# Altium project Diseño2.PrjPcb
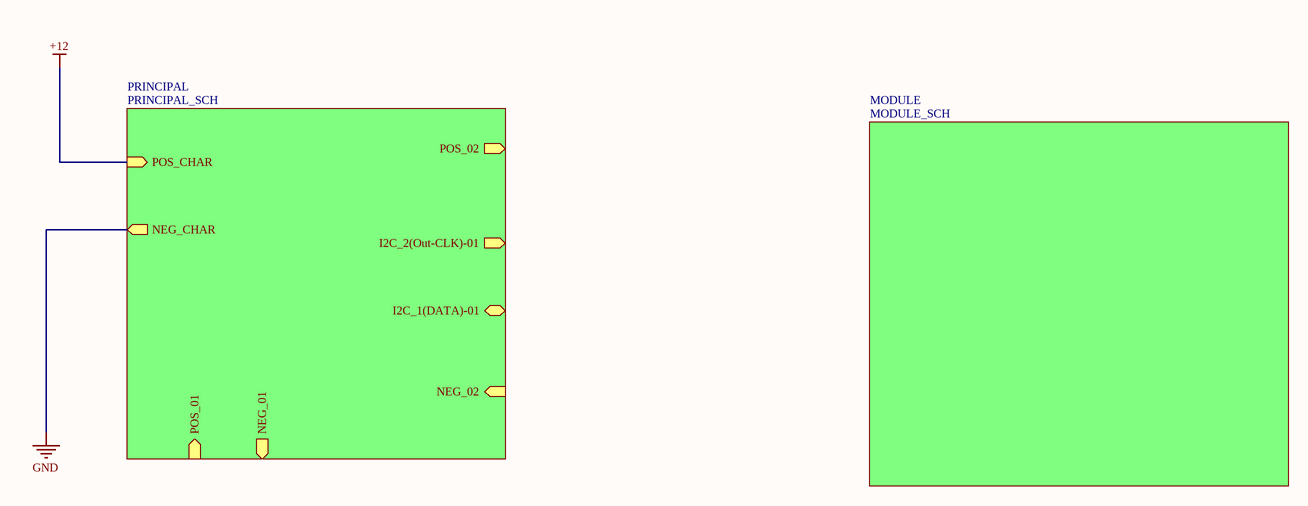
[diagram p0: GENERAL.SchDoc]
3 sheets, 32 parts. Net scope: hierarchical (ports join the sheet entries above them; power ports are global).
Sheets:
  GENERAL.SchDoc
    PRINCIPAL = PRINCIPAL_SCH.SchDoc
    MODULE = MODULE_SCH.SchDoc

## Sheet GENERAL.SchDoc
size A4; SheetNumber: 1; SheetTotal: 5

### Sub-sheets
MODULE = MODULE_SCH: no entries
PRINCIPAL = PRINCIPAL_SCH: POS_02 (out), I2C_2(Out-CLK)-01 (out), I2C_1(DATA)-01 (bidir), NEG_02 (in), POS_CHAR (in), NEG_CHAR (out), POS_01 (in), NEG_01 (out)

### Nets
+12: sheet PRINCIPAL/POS_CHAR
GND: sheet PRINCIPAL/NEG_02, sheet PRINCIPAL/NEG_CHAR, sheet PRINCIPAL/NEG_01

## Sheet PRINCIPAL_SCH.SchDoc
size A4; SheetNumber: 2; SheetTotal: 3
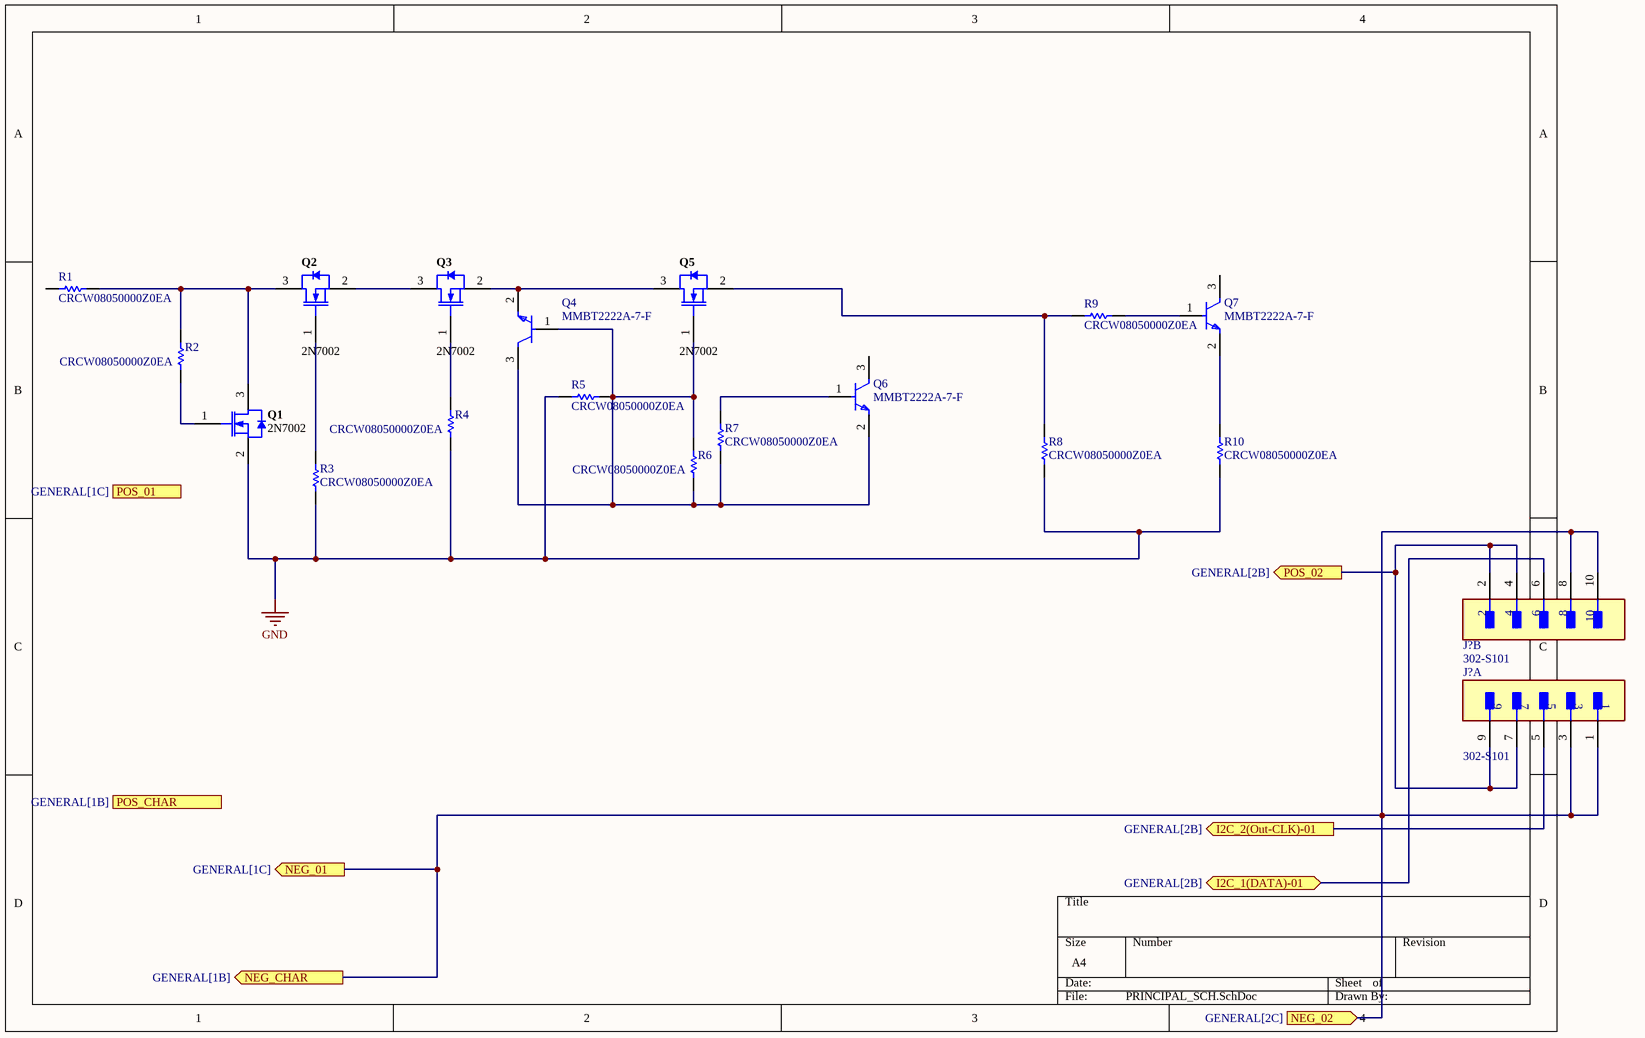
[diagram p1: PRINCIPAL_SCH.SchDoc]

### Parts
(Parts that share a designator on the sheet are numbered #1, #2 ... from top to bottom, then left to right.)
J?#1  302-S101  [FP-302-S101-MFG]  (part B of 2)
J?#2  302-S101  [FP-302-S101-MFG]  (part A of 2)
Q1  2N7002  [INF-PG-SOT23_M]
Q2  2N7002  [INF-PG-SOT23_M]
Q3  2N7002  [INF-PG-SOT23_M]
Q4  MMBT2222A-7-F  [FP-SOT23-IPC_A]
Q5  2N7002  [INF-PG-SOT23_M]
Q6  MMBT2222A-7-F  [FP-SOT23-IPC_A]
Q7  MMBT2222A-7-F  [FP-SOT23-IPC_A]
R1  CRCW08050000Z0EA  [RESC2013X50X30LL20T20]
R2  CRCW08050000Z0EA  [RESC2013X50X30LL20T20]
R3  CRCW08050000Z0EA  [RESC2013X50X30LL20T20]
R4  CRCW08050000Z0EA  [RESC2013X50X30LL20T20]
R5  CRCW08050000Z0EA  [RESC2013X50X30LL20T20]
R6  CRCW08050000Z0EA  [RESC2013X50X30LL20T20]
R7  CRCW08050000Z0EA  [RESC2013X50X30LL20T20]
R8  CRCW08050000Z0EA  [RESC2013X50X30LL20T20]
R9  CRCW08050000Z0EA  [RESC2013X50X30LL20T20]
R10  CRCW08050000Z0EA  [RESC2013X50X30LL20T20]

### Ports
I2C_1(DATA)-01 (bidir, see GENERAL[2B]), I2C_2(Out-CLK)-01 (out, see GENERAL[2B]), NEG_01 (out, see GENERAL[1C]), NEG_02 (in, see GENERAL[2C]), NEG_CHAR (out, see GENERAL[1B]), POS_01 (in, see GENERAL[1C]), POS_02 (out, see GENERAL[2B]), POS_CHAR (in, see GENERAL[1B])

### Nets
GND: J?#1.8 J?#1.10 J?#2.1 J?#2.3 Q1.2(SOURCE) R3.1 R4.1 R5.1 R8.1 R10.1 ; port NEG_02, port NEG_01, port NEG_CHAR
NetJ?#1_2: J?#1.2 J?#1.4 J?#2.7 J?#2.9 ; port POS_02
NetJ?#1_6: J?#1.6 ; port I2C_1(DATA)-01
NetJ?#2_5: J?#2.5 ; port I2C_2(Out-CLK)-01
NetQ1_1: Q1.1(GATE) R2.1
NetQ1_3: Q1.3(DRAIN) Q2.3(DRAIN) R1.2 R2.2
NetQ2_1: Q2.1(GATE) R3.2
NetQ2_2: Q2.2(SOURCE) Q3.3(DRAIN)
NetQ3_1: Q3.1(GATE) R4.2
NetQ3_2: Q3.2(SOURCE) Q4.2(E) Q5.3(DRAIN)
NetQ4_1: Q4.1(B) Q4.3(C) Q5.1(GATE) Q6.2(E) R5.2 R6.1 R6.2 R7.2
NetQ5_2: Q5.2(SOURCE) R8.2 R9.1
NetQ6_1: Q6.1(B) R7.1
NetQ7_1: Q7.1(B) R9.2
NetQ7_2: Q7.2(E) R10.2

Not connected (* = marked no-connect by the designer): Q6 3(C); Q7 3(C); R1 1

### Library data of the parts
J?#1 J?#2 = CMP-15228-000002-1: CONN HEADER VERT 10POS 2.54MM; Voltage Rating: 250V; Row Spacing: 0.1inch; Number of Positions: 10; Mount: Through Hole; Series: 302; Contact Type: Male Pin; Contact Plating: Gold; Contact Material: Brass; Number of Rows: 2; Color: Black; Contact Finish - Mating: GOLD; Packaging: Bulk; Pitch: 0.1inch; Fastening Type: Pull; Insulation Color: Black; Termination: Solder; Flammability Rating: UL94 V-0; Connector Type: Header; Max Operating Temperature: 105°C; Insulation Material: Glass; Contact Shape: Square; Min Operating Temperature: -40°C
Q1-Q3 Q5 = CMP-1149-00026-1: N-Channel OptiMOS Small-Signal-Transistor, 60 V VDS, 0.3 A ID, -55 to 150 degC, PG-SOT23, Reel, Green; Manufacturer: Infineon; RDS (on) (max) (@4.5V): 4,000 mOhm; VDS (max): 60 V; IDpuls (max): 1.2Â A; QG: 0.4Â nC; RDS (on) (max): 3,000 mOhm; RthJA (max): 250 K/W; ID (max): 0.3Â A; VGS(th) (max): 2.5Â V; VGS(th) (min): 1.5Â V; Green: TRUE; Ptot (max): 0.5Â W; PackageDescription: 3-Pin Small Outline Transistor Package, 2.9 x 1.3 mm Body, 0.95 mm Pitch; Halogen-free: TRUE; ComponentLink2Description: Datasheet; ComponentLink1URL: http://www.infineon.com/; Packing: Reel; DatasheetVersion: Rev. 2.4; PartNumber: 2N7002; PackageReference: PG-SOT23; PackageVersion: Apr-08; ComponentLink3URL: http://www.infineon.com/dgdl/SOT23-Package_Overview.pdf?folderId=db3a30431936bc4b0119532290053c66&fileId=db3a30431936bc4b0119533468123c85; ComponentLink1Description: Manufacturer URL; Mounting Technology: Surface Mount; ComponentLink3Description: Package Specification; ComponentLink2URL: http://www.infineon.com/dgdl/2N7002_Rev2.4.pdf?folderId=db3a3043156fd573011622e10b5c1f67&fileId=db3a304319bc939a0119c2a9461e79e6
Q4 Q6 Q7 = CMP-1693-00003-4: TRANS NPN 40V 0.6A SMD SOT23-3; Number of Elements: 1; Frequency: 300MHz; Max Collector Current: 600mA; Collector Base Voltage (VCBO): 75V; Current: 1A; Element Configuration: Single; Power Dissipation: 350mW; hFE Min: 100; Collector Emitter Saturation Voltage: 1V; Max Power Dissipation: 300mW; Emitter Base Voltage (VEBO): 6V; Voltage: 40V; Collector Emitter Breakdown Voltage: 40V; Width: 1.4mm; Polarity: NPN; Termination: SMD/SMT; Max Operating Temperature: 150°C; Transition Frequency: 300MHz; Contact Plating: Tin; Mount: Surface Mount; Max Frequency: 300MHz; Case/Package: SOT-23; Gain Bandwidth Product: 300MHz; Lead Free: Lead Free; Collector Emitter Voltage (VCEO): 40V; Radiation Hardening: No; Voltage Rating (DC): 40V; Height: 1mm; Max Breakdown Voltage: 40V; Packaging: Tape and Reel; Length: 3.05mm; Min Operating Temperature: -55°C; Weight: 0.000282oz; Current Rating: 600mA; REACH SVHC: No SVHC; Package Quantity: 3000; Continuous Collector Current: 600mA; Number of Pins: 3
R1-R10 = CMP-2001-04896-1: Manufacturer: Vishay Dale; Part Number: CRCW08050000Z0EA

## Sheet MODULE_SCH.SchDoc
size A4; SheetNumber: 3; SheetTotal: 3
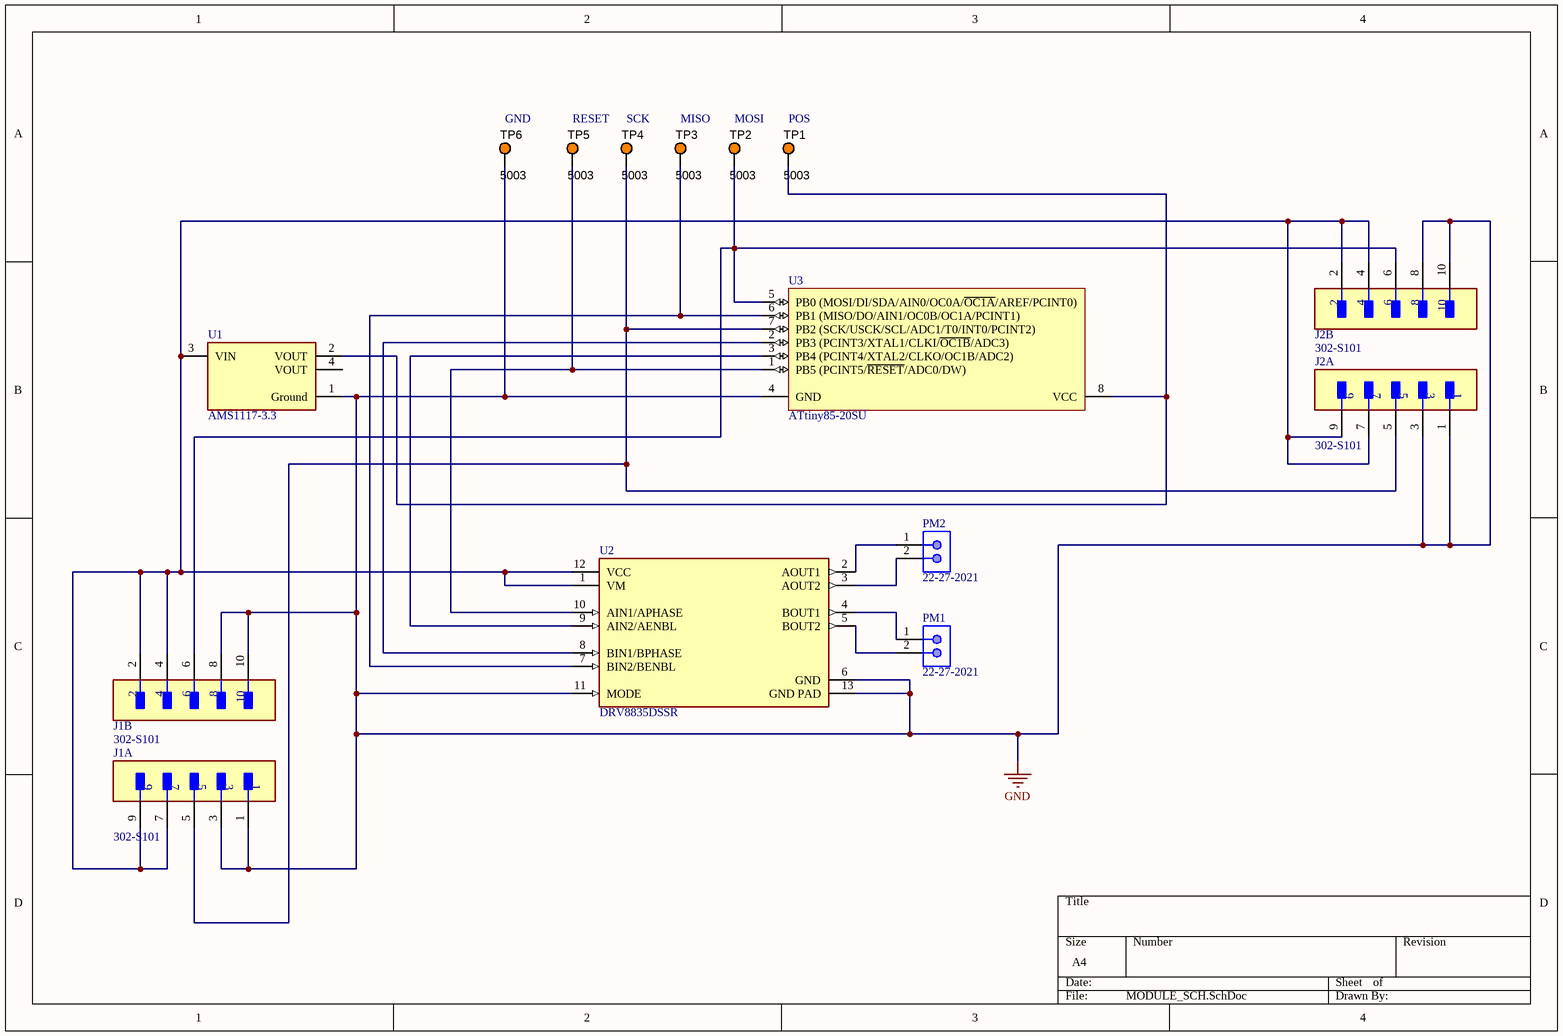
[diagram p2: MODULE_SCH.SchDoc]

### Parts
J1  302-S101  [FP-302-S101-MFG]  (parts A,B of 2)
J2  302-S101  [FP-302-S101-MFG]  (parts A,B of 2)
PM1  22-27-2021  [MOLX-22-27-2021_V]
PM2  22-27-2021  [MOLX-22-27-2021_V]
TP1  5003  [KSTN-5003]
TP2  5003  [KSTN-5003]
TP3  5003  [KSTN-5003]
TP4  5003  [KSTN-5003]
TP5  5003  [KSTN-5003]
TP6  5003  [KSTN-5003]
U1  AMS1117-3.3  [FP-AMS1117-IPC_C]
U2  DRV8835DSSR  [FP-DSS0012A-MFG]
U3  ATtiny85-20SU  [8S2_M]

### Nets
GND: J1.1 J1.3 J1.8 J1.10 J2.1 J2.3 J2.8 J2.10 TP6.1 U1.1(Ground) U2.6(GND) U2.11(MODE) U2.13(GND_PAD) U3.4(GND)
NetJ1_2: J1.2 J1.4 J1.7 J1.9 J2.2 J2.4 J2.7 J2.9 U1.3(VIN) U2.1(VM) U2.12(VCC)
NetJ1_5: J1.5 J2.5 TP4.1 U3.7(PB2_(SCK/USCK/SCL/ADC1/T0/INT0/PCINT2))
NetJ1_6: J1.6 J2.6 TP2.1 U3.5(PB0_(MOSI/DI/SDA/AIN0/OC0A/~{OC1A}/AREF/PCINT0))
NetPM1_1: PM1.1 U2.4(BOUT1)
NetPM1_2: PM1.2 U2.5(BOUT2)
NetPM2_1: PM2.1 U2.2(AOUT1)
NetPM2_2: PM2.2 U2.3(AOUT2)
NetTP1_1: TP1.1 U1.2(VOUT) U3.8(VCC)
NetTP3_1: TP3.1 U2.7(BIN2/BENBL) U3.6(PB1_(MISO/DO/AIN1/OC0B/OC1A/PCINT1))
NetTP5_1: TP5.1 U2.10(AIN1/APHASE) U3.1(PB5_(PCINT5/~{RESET}/ADC0/DW))
NetU2_8: U2.8(BIN1/BPHASE) U3.2(PB3_(PCINT3/XTAL1/CLKI/~{OC1B}/ADC3))
NetU2_9: U2.9(AIN2/AENBL) U3.3(PB4_(PCINT4/XTAL2/CLKO/OC1B/ADC2))

Not connected (* = marked no-connect by the designer): U1 4(VOUT)

### Notes on the sheet
- (near TP6) GND
- RESET
- (near TP4) SCK
- MISO
- MOSI
- (near TP1) POS

### Library data of the parts
J1 J2 = CMP-15228-000002-1: as J?#1 on sheet PRINCIPAL_SCH; Mount: Through Hole; Series: 302; Contact Type: Male Pin; Contact Plating: Gold; Contact Material: Brass; Number of Rows: 2; Color: Black; Contact Finish - Mating: GOLD; Packaging: Bulk; Pitch: 0.1inch; Fastening Type: Pull; Insulation Color: Black; Termination: Solder; Flammability Rating: UL94 V-0; Connector Type: Header; Max Operating Temperature: 105°C; Insulation Material: Glass; Contact Shape: Square; Min Operating Temperature: -40°C
PM1 PM2 = CMP-2000-05537-1: Male Header, Pitch 2.54 mm, 1 x 2 Position, Height 11.7 mm, Tail Length 3.56 mm, 0 to 75 degC, RoHS, Bulk; Manufacturer: Molex; PartNumber: 0022272021; Current rating: 4A; Package Version: Rev. BC, 02/2012; Voltage rating: 250V; No. of Positions: 2; Pitch: 2.54mm; No. of Rows: 1; Orientation: Vertical; Operating temperature: 0°Cto+75°C; Manufacturer URL: http://www.molex.com/; Mounting Technology: ThroughHole; Housing material: Nylon(UL94V-0); Package Description: 2-Leads Header, Body 5.08 x 5.8 mm, Pitch 2.54 mm; Voltage - Max: 250V; Datasheet URL: http://www.molex.com/pdm_docs/sd/022272021_sd.pdf; Package Reference: 22-27-2021; Contact material: Tinplatedbrass; Current - Max: 4A; Datasheet Version: Rev. F, 06/2009
TP1-TP6 = CMP-1672-00009-1: Test Point, Orange, 1-Pin THD, RoHS; Peak Reverse Current: 600 uA; Forward Current: 3 A; Max Surge Current: 80 A; Forward Voltage: 1.08 V; Max Operating Temperature: 150 degC; PackageReference: 5003; Pins: 2; ComponentLink2URL: http://keyelco.com/userAssets/file/M65p56.pdf; PackageDescription: 1-Pin Through Hole Device, Dia 2.54 mm; Weight: 0.01 lb; Diameter: 5.3 mm; Mount: Through Hole; Package Quantity: 500; Packaging: Bulk; Min Operating Temperature: -65 degC; ComponentLink1Description: Manufacturer URL; Height: 0.25 inch; ComponentLink1URL: http://www.keyelco.com/; ComponentLink2Description: Datasheet; Width: 0.25 inch; REACH SVHC: No SVHC; RoHSCompliant: true; Radiation Hardening: No; Length: 9.5 mm; DatasheetVersion: Jun-15
U1 = CMP-209535-000001-1: LDO Voltage Regulators 1A, 3.3V; Manufacturer: Advanced Monolithic Systems; Dropout Voltage: 1.1V; Output Type: Fixed; Nominal Supply Current: 5mA; Max Power Dissipation: 1.2W; Max Supply Voltage: 15V; Number Of Outputs: 1; Standoff Height: 0.64mm; Max Junction Temp: +125°C; Height: 1.8mm; Package: AMS1117; Device Class L2: Power Management ICs; ComponentLink2Description: Datasheet; ComponentLink2URL: http://www.advanced-monolithic.com/pdf/ds1117.pdf; Category: IC; RoHS: TRUE; Automotive: No; Device Class L1: Integrated Circuits (ICs); Output Current: 1A; Device Class L3: Voltage Regulators - Linear; Temperature: -40°C to +125°C; Output Voltage: 3.3V; Manufacturer Part Number: AMS1117-3.3; Temperature Range Low: -40°C; Octopart: https://octopart.com/ams1117-3.3-advanced+monolithic+systems-25899300; Lead Free: Yes; Ipc Land Pattern Name: SOT229P700X180-4; Temperature Range High: +125°C
U2 = CMP-04915-000062-1: IC MTR DRVR BIPOLAR 2-7V 12WSON; Switching Frequency: 250kHz; Output Current: 1.5A; Motor Type: Stepper; Interface: Parallel; Collector Emitter Voltage (VCEO): 11V; Logic Function: AND GATE; Drain to Source Resistance: 305mR; Number of Outputs: 2; Min Supply Voltage: 2V; Max Supply Voltage: 7V; Height: 0.75mm; Radiation Hardening: No; Package Quantity: 3000; Max Collector Current: 1.5A; Number of Pins: 12; Length: 3.1mm; Min Operating Temperature: -40°C; Series: DRV8835; Mount: Surface Mount; Lead Free: Lead Free; Width: 2.1mm; REACH SVHC: No SVHC; Output Voltage: 11V; Case/Package: SON; Packaging: Tape and Reel; Max Operating Temperature: 85°C; Operating Supply Current: 1.5A; RoHS Compliant: Yes
U3 = CMP-0093-00173-2: 8-bit AVR Microcontroller, 20MHz, 2.7-5.5V, 8K Flash, 512 Bytes EEPROM, 512 Bytes SRAM, Industrial Grade (-40°C to 85°C), 8-Lead SOIC, Pb-Free; ComponentLink3Description: ATtiny25/45/85 Summary; DatasheetVersion: revN, Apr-2011; PackageVersion: revF, Apr-2008; ComponentLink3URL: http://www.atmel.com/dyn/resources/prod_documents/2586S.pdf; ComponentLink1URL: http://www.atmel.com/; ComponentLink2Description: ATtiny25/45/85 Datasheet; RevisionNote: DatasheetVersion updated. URLs added.; PackageDescription: 8-Lead, 0.208" Body, Plastic Small Outline Package (EIAJ); ComponentLink1Description: Manufacturer URL; PackageReference: 8S2; ComponentLink2URL: http://www.atmel.com/dyn/resources/prod_documents/doc2586.pdf

## Nets that join several sheets
GND: PRINCIPAL_SCH (10 pins), MODULE_SCH (14 pins)